# EAGLE design schema_v2_2 (EAGLE 6.4)
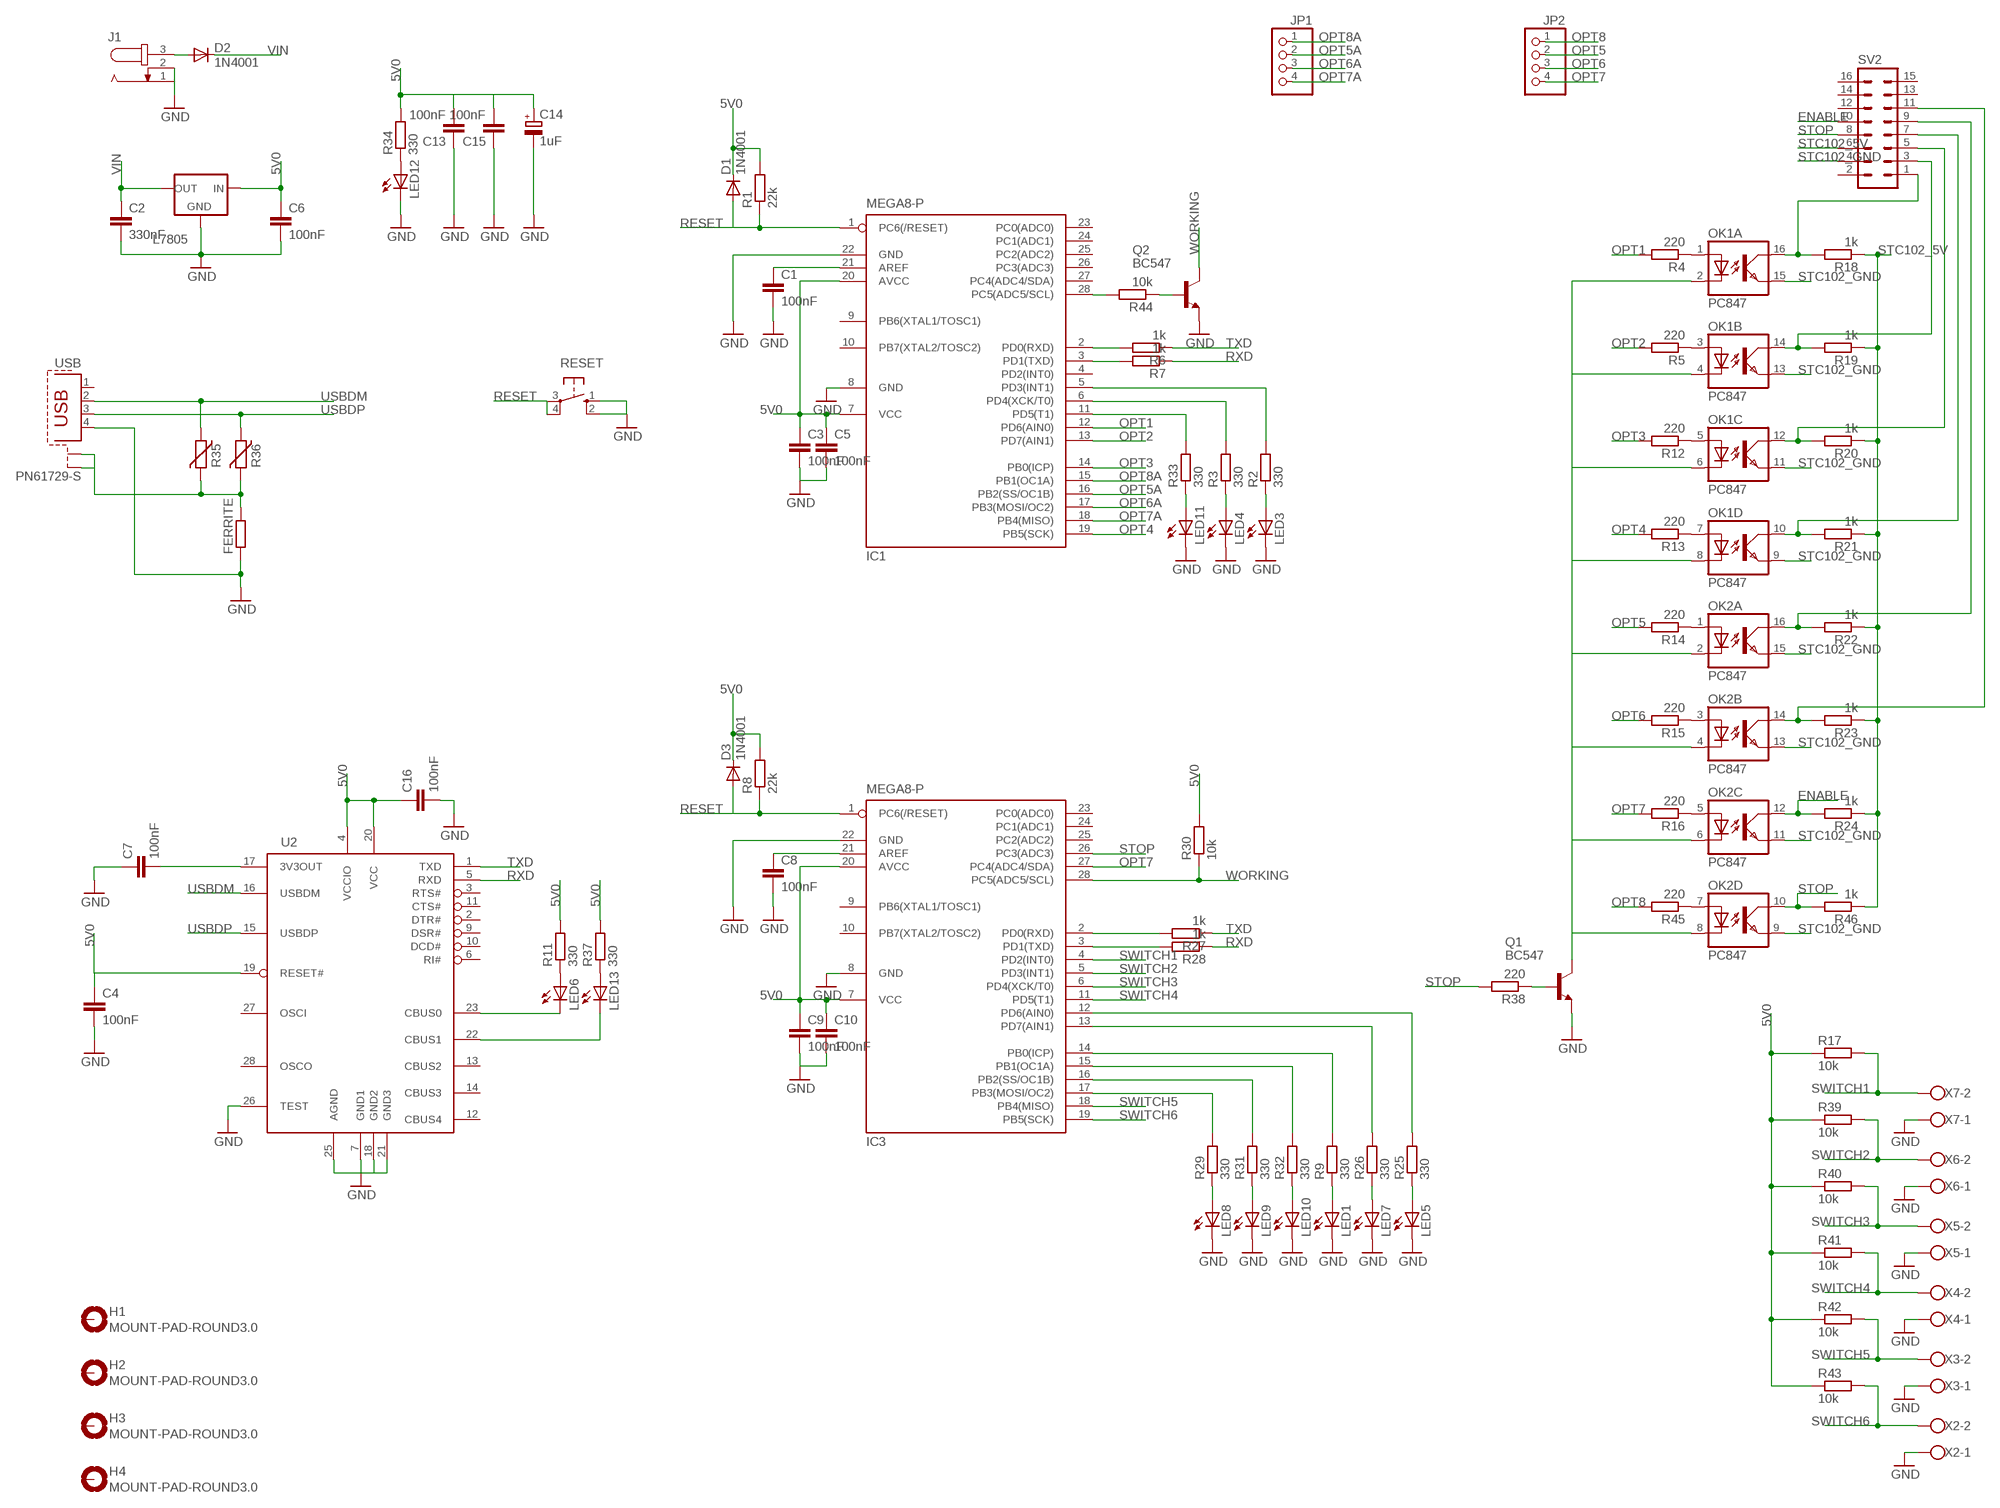
[diagram p0: schematic, sheet 1]

## Parts
C1  100nF  C-EUC0805  [C0805]
C2  330nF  C-EU025-025X050  [C025-025X050]
C3  100nF  C-EU025-025X050  [C025-025X050]
C4  100nF  C-EUC0603K  [C0603K]
C5  100nF  C-EU025-025X050  [C025-025X050]
C6  100nF  C-EU025-025X050  [C025-025X050]
C7  100nF  C-EUC0603K  [C0603K]
C8  100nF  C-EU025-025X050  [C025-025X050]
C9  100nF  C-EU025-025X050  [C025-025X050]
C10  100nF  C-EU025-025X050  [C025-025X050]
C13  100nF  C-EU025-025X050  [C025-025X050]
C14  1uF  CPOL-EUE2.5-5  [E2,5-5]
C15  100nF  C-EU025-025X050  [C025-025X050]
C16  100nF  C-EUC0603K  [C0603K]
D1  1N4001  1N4004  [DO41-10]
D2  1N4001  1N4004  [DO41-10]
D3  1N4001  1N4004  [DO41-10]
FERRITE  R-EU_M0805  [M0805]
H1  MOUNT-PAD-ROUND3.0  [3,0-PAD]
H2  MOUNT-PAD-ROUND3.0  [3,0-PAD]
H3  MOUNT-PAD-ROUND3.0  [3,0-PAD]
H4  MOUNT-PAD-ROUND3.0  [3,0-PAD]
IC1  MEGA8-P  [DIL28-3]
IC3  MEGA8-P  [DIL28-3]
J1  JACK-PLUG0  [SPC4077]
JP1  PINHD-1X4  [1X04]
JP2  PINHD-1X4  [1X04]
L7805  79XXS  [79XXS]
LED1  LED3MM  [LED3MM]
LED3  LED3MM  [LED3MM]
LED4  LED3MM  [LED3MM]
LED5  LED3MM  [LED3MM]
LED6  LED3MM  [LED3MM]
LED7  LED3MM  [LED3MM]
LED8  LED3MM  [LED3MM]
LED9  LED3MM  [LED3MM]
LED10  LED3MM  [LED3MM]
LED11  LED3MM  [LED3MM]
LED12  LED3MM  [LED3MM]
LED13  LED3MM  [LED3MM]
OK1  PC847  [DIL16]
OK2  PC847  [DIL16]
Q1  BC547  [TO92]
Q2  BC547  [TO92]
R1  22k  R-EU_0207/10  [0207/10]
R2  330  R-EU_0207/10  [0207/10]
R3  330  R-EU_0207/10  [0207/10]
R4  220  R-EU_0207/10  [0207/10]
R5  220  R-EU_0207/10  [0207/10]
R6  1k  R-EU_0207/10  [0207/10]
R7  1k  R-EU_0207/10  [0207/10]
R8  22k  R-EU_0207/10  [0207/10]
R9  330  R-EU_0207/10  [0207/10]
R11  330  R-EU_0207/10  [0207/10]
R12  220  R-EU_0207/10  [0207/10]
R13  220  R-EU_0207/10  [0207/10]
R14  220  R-EU_0207/10  [0207/10]
R15  220  R-EU_0207/10  [0207/10]
R16  220  R-EU_0207/10  [0207/10]
R17  10k  R-EU_0207/10  [0207/10]
R18  1k  R-EU_0207/10  [0207/10]
R19  1k  R-EU_0207/10  [0207/10]
R20  1k  R-EU_0207/10  [0207/10]
R21  1k  R-EU_0207/10  [0207/10]
R22  1k  R-EU_0207/10  [0207/10]
R23  1k  R-EU_0207/10  [0207/10]
R24  1k  R-EU_0207/10  [0207/10]
R25  330  R-EU_0207/10  [0207/10]
R26  330  R-EU_0207/10  [0207/10]
R27  1k  R-EU_0207/10  [0207/10]
R28  1k  R-EU_0207/10  [0207/10]
R29  330  R-EU_0207/10  [0207/10]
R30  10k  R-EU_0207/10  [0207/10]
R31  330  R-EU_0207/10  [0207/10]
R32  330  R-EU_0207/10  [0207/10]
R33  330  R-EU_0207/10  [0207/10]
R34  330  R-EU_0207/10  [0207/10]
R35  VARISTORCN0603  [CT/CN0603]
R36  VARISTORCN0603  [CT/CN0603]
R37  330  R-EU_0207/10  [0207/10]
R38  220  R-EU_0207/10  [0207/10]
R39  10k  R-EU_0207/10  [0207/10]
R40  10k  R-EU_0207/10  [0207/10]
R41  10k  R-EU_0207/10  [0207/10]
R42  10k  R-EU_0207/10  [0207/10]
R43  10k  R-EU_0207/10  [0207/10]
R44  10k  R-EU_0207/10  [0207/10]
R45  220  R-EU_0207/10  [0207/10]
R46  1k  R-EU_0207/10  [0207/10]
RESET  10-XX  [B3F-10XX]
SV2  MA08-2  [MA08-2]
U2  FT232RL  [SSOP28DB]
USB  PN61729-S  [PN61729-S]
X2  W237-102  [W237-102]
X3  W237-102  [W237-102]
X4  W237-102  [W237-102]
X5  W237-102  [W237-102]
X6  W237-102  [W237-102]
X7  W237-102  [W237-102]

## Nets
5V0: C3.1 C4.1 C5.1 C6.1 C9.1 C10.1 C13.2 C14.+ C15.2 C16.1 D1.C D3.C IC1.7(VCC) IC1.20(AVCC) IC3.7(VCC) IC3.20(AVCC) L7805.IN R1.2 R8.2 R11.2 R17.1 R30.2 R34.2 R37.2 R39.1 R40.1 R41.1 R42.1 R43.1 U2.4(VCCIO) U2.19(RESET#) U2.20(VCC)
ENABLE: OK2.12(C:COL) R24.2 SV2.10
GND: C1.2 C2.2 C3.2 C4.2 C5.2 C6.2 C7.1 C8.2 C9.2 C10.2 C13.1 C14.- C15.1 C16.2 FERRITE.1 IC1.8(GND) IC1.22(GND) IC3.8(GND) IC3.22(GND) J1.1 J1.2 L7805.GND LED1.K(C) LED3.K(C) LED4.K(C) LED5.K(C) LED7.K(C) LED8.K(C) LED9.K(C) LED10.K(C) LED11.K(C) LED12.K(C) Q1.1(E) Q2.1(E) RESET.1(S) RESET.2(S1) U2.7(GND1) U2.18(GND2) U2.21(GND3) U2.25(AGND) U2.26(TEST) USB.4 X2.1 X3.1 X4.1 X5.1 X6.1 X7.1
N$1: IC1.28(PC5(ADC5/SCL)) R44.2
N$2: LED1.A R9.1
N$3: C1.1 IC1.21(AREF)
N$4: IC1.6(PD4(XCK/T0)) R3.2
N$5: IC3.13(PD7(AIN1)) R26.2
N$6: LED3.A R2.1
N$7: LED4.A R3.1
N$8: D2.A J1.3
N$9: OK1.16(A:COL) R18.2 SV2.1
N$10: IC1.5(PD3(INT1)) R2.2
N$11: OK1.14(B:COL) R19.2 SV2.3
N$12: OK1.12(C:COL) R20.2 SV2.5
N$13: OK1.10(D:COL) R21.2 SV2.7
N$14: OK2.16(A:COL) R22.2 SV2.9
N$15: OK2.14(B:COL) R23.2 SV2.11
N$16: C8.1 IC3.21(AREF)
N$17: LED6.K(C) U2.23(CBUS0)
N$18: LED13.K(C) U2.22(CBUS1)
N$19: LED6.A R11.1
N$20: Q2.2(B) R44.1
N$21: IC3.14(PB0(ICP)) R9.2
N$22: OK2.7(D:A) R45.1
N$23: OK1.2(A:C) OK1.4(B:C) OK1.6(C:C) OK1.8(D:C) OK2.2(A:C) OK2.4(B:C) OK2.6(C:C) OK2.8(D:C) Q1.3(C)
N$24: Q1.2(B) R38.1
N$25: IC1.2(PD0(RXD)) R6.2
N$26: IC1.3(PD1(TXD)) R7.2
N$29: OK1.1(A:A) R4.1
N$30: OK1.3(B:A) R5.1
N$31: OK1.5(C:A) R12.1
N$32: OK1.7(D:A) R13.1
N$33: OK2.1(A:A) R14.1
N$34: OK2.3(B:A) R15.1
N$35: OK2.5(C:A) R16.1
N$36: LED5.A R25.1
N$38: LED7.A R26.1
N$39: LED8.A R29.1
N$40: LED10.A R32.1
N$42: LED9.A R31.1
N$43: IC3.2(PD0(RXD)) R27.2
N$44: IC3.3(PD1(TXD)) R28.2
N$45: IC3.12(PD6(AIN0)) R25.2
N$46: IC3.17(PB3(MOSI/OC2)) R29.2
N$47: IC3.16(PB2(SS/OC1B)) R31.2
N$48: IC3.15(PB1(OC1A)) R32.2
N$49: LED11.A R33.1
N$50: IC1.11(PD5(T1)) R33.2
N$51: LED12.A R34.1
N$53: FERRITE.2 R35.2 R36.2 USB.S1 USB.S2
N$55: LED13.A R37.1
N$96: C7.2 U2.17(3V3OUT)
OPT1: IC1.12(PD6(AIN0)) R4.2
OPT2: IC1.13(PD7(AIN1)) R5.2
OPT3: IC1.14(PB0(ICP)) R12.2
OPT4: IC1.19(PB5(SCK)) R13.2
OPT5: JP2.2 R14.2
OPT5A: IC1.16(PB2(SS/OC1B)) JP1.2
OPT6: JP2.3 R15.2
OPT6A: IC1.17(PB3(MOSI/OC2)) JP1.3
OPT7: IC3.27(PC4(ADC4/SDA)) JP2.4 R16.2
OPT7A: IC1.18(PB4(MISO)) JP1.4
OPT8: JP2.1 R45.2
OPT8A: IC1.15(PB1(OC1A)) JP1.1
RESET: D1.A D3.A IC1.1(PC6(/RESET)) IC3.1(PC6(/RESET)) R1.1 R8.1 RESET.3(P) RESET.4(P1)
RXD: R7.1 R28.1 U2.5(RXD)
STC102_5V: R18.1 R19.1 R20.1 R21.1 R22.1 R23.1 R24.1 R46.1 SV2.6
STC102_GND: OK1.9(D:EMIT) OK1.11(C:EMIT) OK1.13(B:EMIT) OK1.15(A:EMIT) OK2.9(D:EMIT) OK2.11(C:EMIT) OK2.13(B:EMIT) OK2.15(A:EMIT) SV2.4
STOP: IC3.26(PC3(ADC3)) OK2.10(D:COL) R38.2 R46.2 SV2.8
SWITCH1: IC3.4(PD2(INT0)) R17.2 X7.2
SWITCH2: IC3.5(PD3(INT1)) R39.2 X6.2
SWITCH3: IC3.6(PD4(XCK/T0)) R40.2 X5.2
SWITCH4: IC3.11(PD5(T1)) R41.2 X4.2
SWITCH5: IC3.18(PB4(MISO)) R42.2 X3.2
SWITCH6: IC3.19(PB5(SCK)) R43.2 X2.2
TXD: R6.1 R27.1 U2.1(TXD)
USBDM: R35.1 U2.16(USBDM) USB.2
USBDP: R36.1 U2.15(USBDP) USB.3
VIN: C2.1 D2.C L7805.OUT
WORKING: IC3.28(PC5(ADC5/SCL)) Q2.3(C) R30.1
Unconnected: H1.B3,0(MOUNT) H2.B3,0(MOUNT) H3.B3,0(MOUNT) H4.B3,0(MOUNT) IC1.4(PD2(INT0)) IC1.9(PB6(XTAL1/TOSC1)) IC1.10(PB7(XTAL2/TOSC2)) IC1.23(PC0(ADC0)) IC1.24(PC1(ADC1)) IC1.25(PC2(ADC2)) IC1.26(PC3(ADC3)) IC1.27(PC4(ADC4/SDA)) IC3.9(PB6(XTAL1/TOSC1)) IC3.10(PB7(XTAL2/TOSC2)) IC3.23(PC0(ADC0)) IC3.24(PC1(ADC1)) IC3.25(PC2(ADC2)) SV2.2 SV2.12 SV2.13 SV2.14 SV2.15 SV2.16 U2.2(DTR#) U2.3(RTS#) U2.6(RI#) U2.9(DSR#) U2.10(DCD#) U2.11(CTS#) U2.12(CBUS4) U2.13(CBUS2) U2.14(CBUS3) U2.27(OSCI) U2.28(OSCO) USB.1

## Library data of the parts
C1-C10 C13 C15 C16 = rcl:C-EU: CAPACITOR, European symbol
C14 = rcl:CPOL-EU: POLARIZED CAPACITOR, European symbol
D1-D3 = diode:1N4004: DIODE general purpose rectifier, 1 A
FERRITE = resistor:R-EU_: RESISTOR, European symbol
H1-H4 = holes:MOUNT-PAD-ROUND: MOUNTING PAD, round
IC1 IC3 = atmel:MEGA8-P: MICROCONTROLLER 8 Kbytes FLASH, 1 kbytes SRAM, 512 bytes EEPROM, USART, 4-channel 10 bit ADC, 2-channel 8 bit ADC Pin compatible with Atmega48, ATMega88, ATMega168 Source: avr.lbr; OC_FARNELL: unknown; OC_NEWARK: unknown
J1 = con-jack:JACK-PLUG: DC POWER JACK Power Jack, DC, Right Angle, Through Hole, Rated 5A at 16VDC, PC Terminals Distributor: Farnell (www.Farnell.de) Drawing: 84N1161.pdf / 84N1162.pdf Manufacturer: SPC Technology (www.spctechnology.com) Type: SPC4077 / SPC 4078; OC_FARNELL: unknown; OC_NEWARK: unknown
JP1 JP2 = pinhead:PINHD-1X4: PIN HEADER
L7805 = v-reg:79XXS: VOLTAGE REGULATOR
LED1 LED3-LED13 = led:LED: LED OSRAM: - CHIPLED LG R971, LG N971, LY N971, LG Q971, LY Q971, LO R971, LY R971 LH N974, LH R974 LS Q976, LO Q976, LY Q976 LO Q996 - Hyper CHIPLED LW Q18S LB Q993, LB Q99A, LB R99A - SideLED LS A670, LO A670, LY A670, LG A670, LP A670 LB A673, LV A673, LT A673, LW A673 LH A674 LY A675 LS A676, LA A676, LO A676, LY A676, LW A676 LS A679, LY A679, LG A679 - Hyper Micro SIDELED® LS Y876, LA Y876, LO Y876, LY Y876 LT Y87S - SmartLED LW L88C, LW L88S LB L89C, LB L89S, LG L890 LS L89K, LO L89K, LY L89K LS L896, LA L896, LO L896, LY L896 - TOPLED LS T670, LO T670, LY T670, LG T670, LP T670 LSG T670, LSP T670, LSY T670, LOP T670, LYG T670 LG T671, LOG T671, LSG T671 LB T673, LV T673, LT T673, LW T673 LH T674 LS T676, LA T676, LO T676, LY T676, LB T676, LH T676, LSB T676, LW T676 LB T67C, LV T67C, LT T67C, LS T67K, LO T67K, LY T67K, LW E67C LS E67B, LA E67B, LO E67B, LY E67B, LB E67C, LV E67C, LT E67C LW T67C LS T679, LY T679, LG T679 LS T770, LO T770, LY T770, LG T770, LP T770 LB T773, LV T773, LT T773, LW T773 LH T774 LS E675, LA E675, LY E675, LS T675 LS T776, LA T776, LO T776, LY T776, LB T776 LHGB T686 LT T68C, LB T68C - Hyper Mini TOPLED® LB M676 - Mini TOPLED Santana® LG M470 LS M47K, LO M47K, LY M47K Source: http://www.osram.convergy.de LUXEON: - LUMILED® LXK2-PW12-R00, LXK2-PW12-S00, LXK2-PW14-U00, LXK2-PW14-V00 LXK2-PM12-R00, LXK2-PM12-S00, LXK2-PM14-U00 LXK2-PE12-Q00, LXK2-PE12-R00, LXK2-PE12-S00, LXK2-PE14-T00, LXK2-PE14-U00 LXK2-PB12-K00, LXK2-PB12-L00, LXK2-PB12-M00, LXK2-PB14-N00, LXK2-PB14-P00, LXK2-PB14-Q00 LXK2-PR12-L00, LXK2-PR12-M00, LXK2-PR14-Q00, LXK2-PR14-R00 LXK2-PD12-Q00, LXK2-PD12-R00, LXK2-PD12-S00 LXK2-PH12-R00, LXK2-PH12-S00 LXK2-PL12-P00, LXK2-PL12-Q00, LXK2-PL12-R00 Source: www.luxeon.com KINGBRIGHT: KA-3528ASYC Source: www.kingbright.com
OK1 OK2 = optocoupler:PC847: SHARP OPTO COUPLER; OC_FARNELL: 9707735; OC_NEWARK: unknown
Q1 Q2 = transistor-npn:BC547*: NPN Transistor
R1-R9 R11-R34 R37-R46 = rcl:R-EU_: RESISTOR, European symbol
R35 R36 = varistor:VARISTOR: VARISTOR
RESET = switch-omron:10-XX: OMRON SWITCH; MPN: B3F-1000; OC_FARNELL: 176432; OC_NEWARK: 36M3542
SV2 = con-lstb:MA08-2: PIN HEADER; OC_FARNELL: unknown; OC_NEWARK: unknown
U2 = ftdichip-5:FT232RL: USB UART 4th Generation USB UART (USB <-> Serial) Controller
USB = con-berg:PN61729-S: BERG USB connector; OC_FARNELL: unknown; OC_NEWARK: unknown
X2-X7 = con-wago-500:W237-102: WAGO SCREW CLAMP; MPN: 237-102; OC_FARNELL: unknown; OC_NEWARK: 70K9898

## Net classes
0 default: width 0.203 mm

## Board
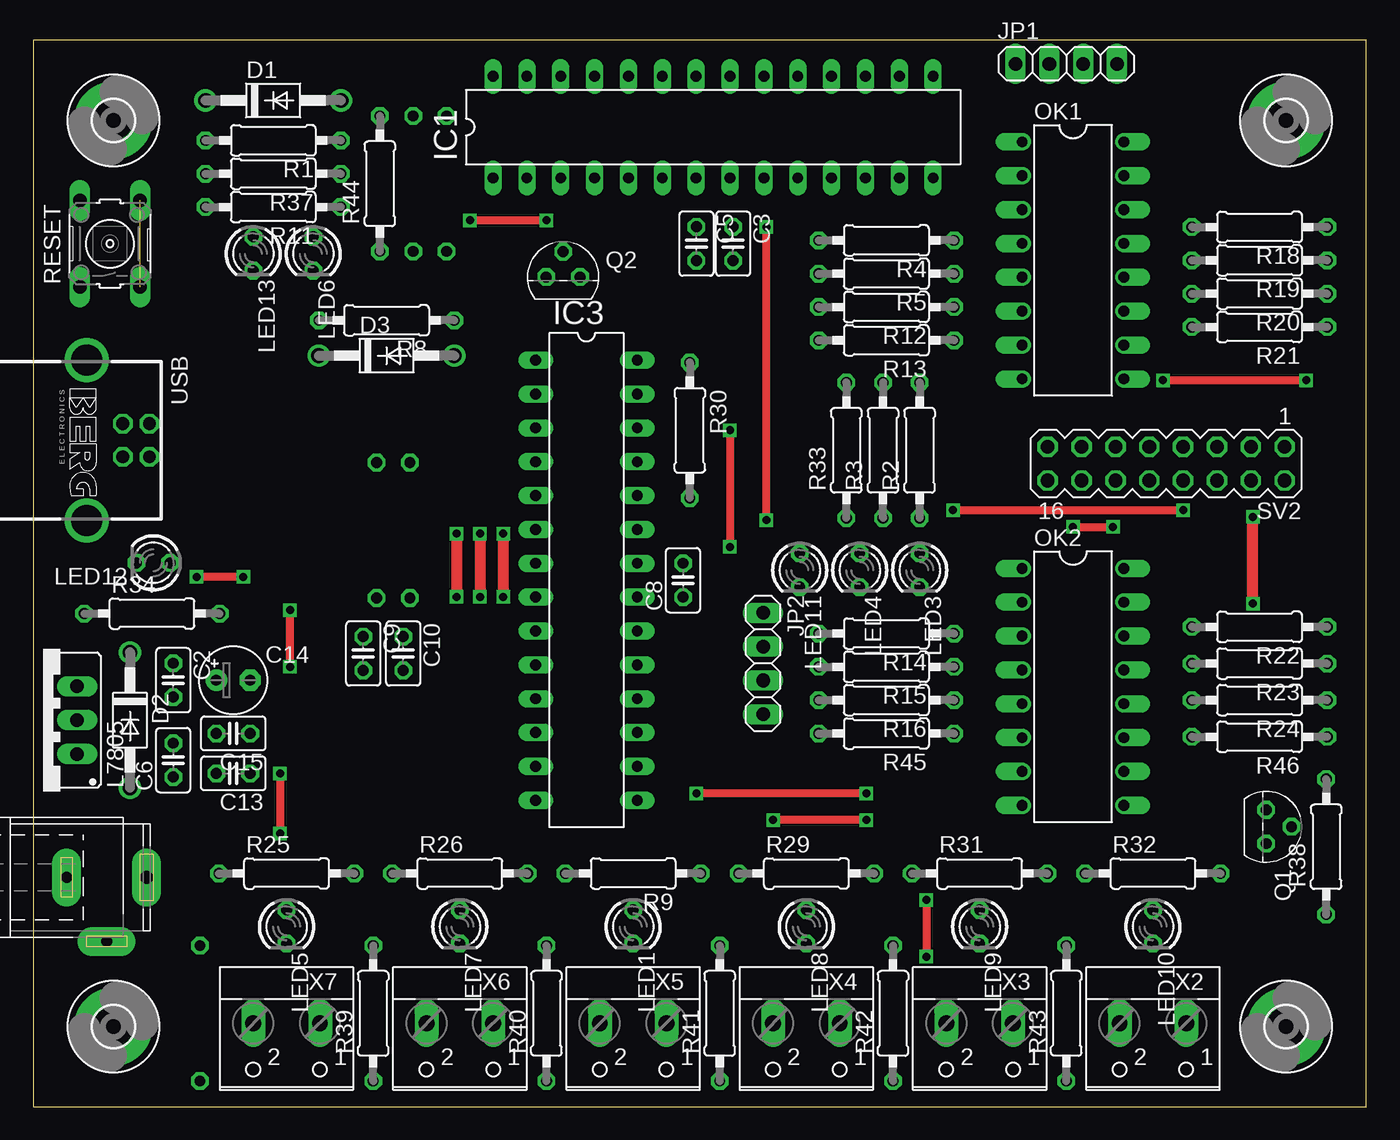
[diagram p1: board, top side]
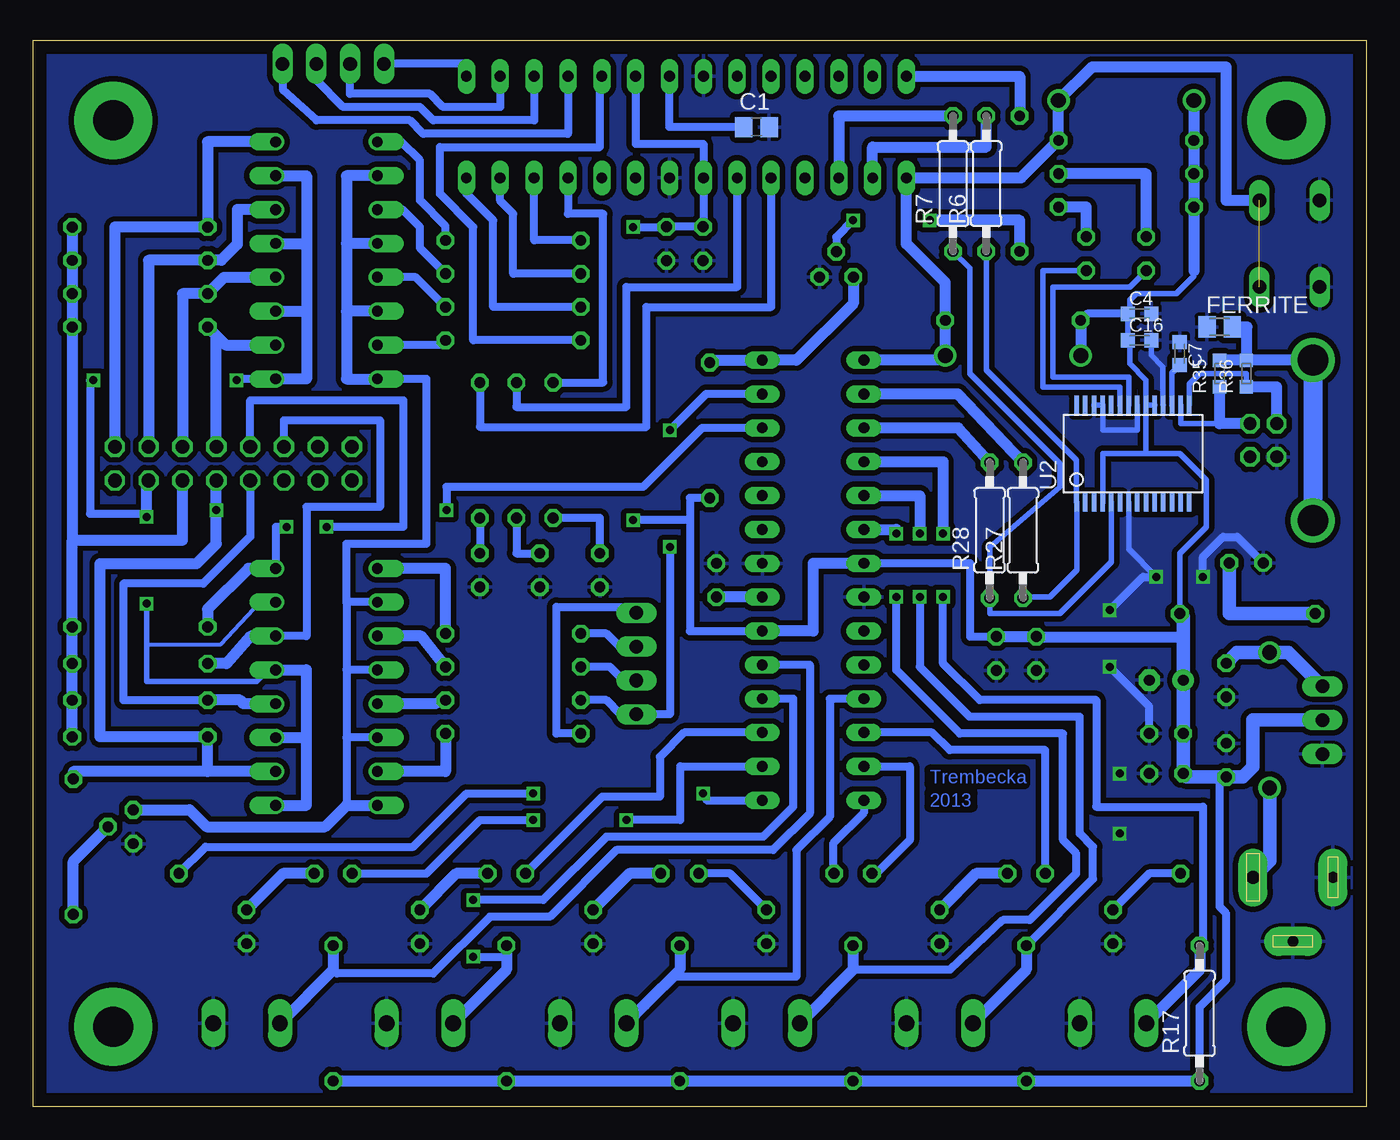
[diagram p2: board, bottom side, seen from below]

Size 100 x 80 mm. Coordinates in mm from the lower left corner, seen from the top.
Outline: 0,0 100,0 100,80 0,80 0,0
Copper layers (1*16): Top 0.035mm / dielectric 1.5mm / Bottom 0.035mm
Design rules "default": minimum track width 10mil, minimum drill 24mil, track to track 8mil, track to pad 8mil, pad to pad 8mil, via to via 8mil, smd to smd 8mil, copper to edge 40mil, drill to drill 8mil, minimum pad ring 10mil, minimum via ring 8mil, stop-mask expansion 4mil, vias tented up to drill 0mil, thermal gap 10mil

### Footprints (pad centres in the part's own frame; a part is rotated, then mirrored left to right if it is on the bottom)
C0805 = smd 1.3 x 1.5: 1 -0.95,0; 2 0.95,0
C025-025X050 = drill 0.813 octagon: 1 -1.27,0; 2 1.27,0
C0603K = smd 1.05 x 1.08: 1 -0.875,0; 2 0.875,0
E2,5-5 = drill 0.813 pad 1.6: + -1.27,0 | drill 0.813 pad 1.6 octagon: - 1.27,0
DO41-10 = drill 1.118: A 5.08,0; C -5.08,0
M0805 = smd 1.3 x 1.6: 1 -0.95,0; 2 0.95,0
3,0-PAD = drill 3 pad 5.842: B3,0 0,0
DIL28-3 = drill 0.813 long: 1 -16.51,-3.81; 2 -13.97,-3.81; 3 -11.43,-3.81; 4 -8.89,-3.81; 5 -6.35,-3.81; 6 -3.81,-3.81; 7 -1.27,-3.81; 8 1.27,-3.81; 9 3.81,-3.81; 10 6.35,-3.81; 11 8.89,-3.81; 12 11.43,-3.81; 13 13.97,-3.81; 14 16.51,-3.81; 15 16.51,3.81; 16 13.97,3.81; 17 11.43,3.81; 18 8.89,3.81; 19 6.35,3.81; 20 3.81,3.81; 21 1.27,3.81; 22 -1.27,3.81; 23 -3.81,3.81; 24 -6.35,3.81; 25 -8.89,3.81; 26 -11.43,3.81; 27 -13.97,3.81; 28 -16.51,3.81
SPC4077 = drill 0.8 pad 2.184 long: 1 -3,0; 2 0,-4.8 | drill 1 pad 2.184 long: 3 3,0
1X04 = drill 1.016 long: 1 -3.81,0; 2 -1.27,0; 3 1.27,0; 4 3.81,0
79XXS = drill 1.016 long: GND -2.54,-2.54; IN 0,-2.54; OUT 2.54,-2.54
LED3MM = drill 0.813 octagon: A -1.27,0; K 1.27,0
DIL16 = drill 0.813 offset: 1 -8.89,-3.81; 2 -6.35,-3.81; 3 -3.81,-3.81; 4 -1.27,-3.81; 5 1.27,-3.81; 6 3.81,-3.81; 7 6.35,-3.81; 8 8.89,-3.81; 9 8.89,3.81; 10 6.35,3.81; 11 3.81,3.81; 12 1.27,3.81; 13 -1.27,3.81; 14 -3.81,3.81; 15 -6.35,3.81; 16 -8.89,3.81
TO92 = drill 0.813 octagon: 1 1.27,0; 2 0,1.905; 3 -1.27,0
0207/10 = drill 0.813 octagon: 1 -5.08,0; 2 5.08,0
CT/CN0603 = smd 1 x 1: 1 -1,0; 2 1,0
B3F-10XX = drill 1.016 long: 1 -3.251,2.261; 2 3.251,2.261; 3 -3.251,-2.261; 4 3.251,-2.261
MA08-2 = drill 1.016 octagon: 1 -8.89,-1.27; 2 -8.89,1.27; 3 -6.35,-1.27; 4 -6.35,1.27; 5 -3.81,-1.27; 6 -3.81,1.27; 7 -1.27,-1.27; 8 -1.27,1.27; 9 1.27,-1.27; 10 1.27,1.27; 11 3.81,-1.27; 12 3.81,1.27; 13 6.35,-1.27; 14 6.35,1.27; 15 8.89,-1.27; 16 8.89,1.27
SSOP28DB = smd 0.348 x 1.397: 1 -4.225,-3.656; 2 -3.575,-3.656; 3 -2.925,-3.656; 4 -2.275,-3.656; 5 -1.625,-3.656; 6 -0.975,-3.656; 7 -0.325,-3.656; 8 0.325,-3.656; 9 0.975,-3.656; 10 1.625,-3.656; 11 2.275,-3.656; 12 2.925,-3.656; 13 3.575,-3.656; 14 4.225,-3.656; 15 4.225,3.656; 16 3.575,3.656; 17 2.925,3.656; 18 2.275,3.656; 19 1.625,3.656; 20 0.975,3.656; 21 0.325,3.656; 22 -0.325,3.656; 23 -0.975,3.656; 24 -1.625,3.656; 25 -2.275,3.656; 26 -2.925,3.656; 27 -3.575,3.656; 28 -4.225,3.656
PN61729-S = drill 0.95 octagon: 1 1.25,4.71; 2 -1.25,4.71; 3 -1.25,2.71; 4 1.25,2.71 | drill 2.3 pad 2.9: S1 -6.02,0; S2 6.02,0
W237-102 = drill 1.194 long: 1 -2.5,-1.27; 2 2.5,-1.27

### Placement (x,y rotation side)
C1  45.75,73.5 0 bottom
C2  10.5,32 270 top
C3  52.5,64.75 270 top
C4  17,59.5 0 bottom
C5  49.75,64.75 270 top
C6  10.5,26 90 top
C7  14,56.5 270 bottom
C8  48.75,39.5 90 top
C9  24.75,34 270 top
C10  27.75,34 270 top
C13  15,25 180 top
C14  15,32 0 top
C15  15,28 180 top
C16  17,57.5 0 bottom
D1  18,75.5 0 top
D2  7.25,29 270 top
D3  26.5,56.35 0 top
FERRITE  11,58.5 0 bottom
H1  94,74 0 top
H2  6,74 0 top
H3  6,6 0 top
H4  94,6 0 top
IC1  51,73.5 0 top
IC3  41.5,39.5 270 top
J1  5.5,17.2 0 top
JP1  77.5,78.25 0 top
JP2  54.75,33.25 270 top
L7805  0.75,29 90 top
LED1  45,13.5 270 top
LED3  66.5,40.25 270 top
LED4  62,40.25 270 top
LED5  19,13.5 270 top
LED6  21,64 270 top
LED7  32,13.5 270 top
LED8  58,13.5 270 top
LED9  71,13.5 270 top
LED10  84,13.5 270 top
LED11  57.5,40.25 270 top
LED12  9,40.8 180 top
LED13  16.5,64 270 top
OK1  78,63.5 270 top
OK2  78,31.5 270 top
Q1  92.5,21 270 top
Q2  39.75,62.25 0 top
R1  18,72.5 180 top
R2  66.5,49.25 90 top
R3  63.75,49.25 90 top
R4  64,65 180 top
R5  64,62.5 180 top
R6  28.5,69.25 90 bottom
R7  31,69.25 90 bottom
R8  26.5,59 180 top
R9  45,17.5 180 top
R11  18,67.5 180 top
R12  64,60 180 top
R13  64,57.5 180 top
R14  64,35.5 180 top
R15  64,33 180 top
R16  64,30.5 180 top
R17  12.5,7 90 bottom
R18  92,66 180 top
R19  92,63.5 180 top
R20  92,61 180 top
R21  92,58.5 180 top
R22  92,36 180 top
R23  92,33.25 180 top
R24  92,30.5 180 top
R25  19,17.5 0 top
R26  32,17.5 0 top
R27  25.75,43.25 90 bottom
R28  28.25,43.25 90 bottom
R29  58,17.5 0 top
R30  49.25,50.75 270 top
R31  71,17.5 0 top
R32  84,17.5 0 top
R33  61,49.25 90 top
R34  8.9,37 0 top
R35  11,55 90 bottom
R36  9,55 90 bottom
R37  18,70 180 top
R38  97,19.5 90 top
R39  25.5,7 90 top
R40  38.5,7 90 top
R41  51.5,7 90 top
R42  64.5,7 90 top
R43  77.5,7 90 top
R44  26,69.25 90 top
R45  64,28 180 top
R46  92,27.75 180 top
RESET  5.75,64.75 90 top
SV2  85,48.25 180 top
U2  17.5,49 0 bottom
USB  4,50 270 top
X2  84,5 180 top
X3  71,5 180 top
X4  58,5 180 top
X5  45,5 180 top
X6  32,5 180 top
X7  19,5 180 top

### Tracks (layer width: path | path; a pad name or v marks a point on that pad's centre or on a via)
5V0  (via drill 0.6)
  Top 0.61: v55,44 v55,66
  Bottom 0.406: U2.19 U2.20 | U2.20 16.52,49 | 16.52,49 19.77,49 U2.4 | 16.52,49 14,49 12,47 12,43.5 13.98,41.52 R34.2 | U2.20 16.52,54.52 17.75,55.75 17.75,57.38 C16.1 C4.1 17.75,59.62 17.75,60.5 17.25,61 14.25,61 12.92,62.33 12.92,62.7
  Bottom 0.61: R17.1 12.5,7.5 10.5,9.5 10.5,14.5 11,15 11,24.73 | IC1.20 54.81,72.25 49.73,72.25 IC1.7 49.73,66.02 C5.1 C3.1 53,66 v55,66 | 50.75,44 50.75,35.69 IC3.20 | IC3.7 29.73,40.77 29.73,35.27 C10.1 | R30.2 50.75,45.67 50.75,44 | 50.75,44 v55,44 | C4.1 20.92,59.5 R8.2
  Bottom 0.813: R17.1 R39.1 R40.1 R41.1 R42.1 R43.1 | D1.C R1.2 R37.2 R11.2 12.92,62.7 | R8.2 D3.C | IC3.7 41.5,40.77 41.5,35.69 IC3.20 | C10.1 C9.1 24.75,35.25 13.73,35.25
  Bottom 1.016: R34.2 13.73,36.75 13.73,35.25 C14.+ C15.2 C13.2 13.46,24.73 11,24.73 C6.1 9.27,24.73 8.5,25.5 8.5,29 L7805.IN
ENABLE
  Bottom 0.61: SV2.10 83.73,42.77 87.25,39.25 93.25,39.25 93.25,30.5 R24.2
  Bottom 0.813: OK2.12 84.23,30.23 84.5,30.5 R24.2
GND  (via drill 0.6)
  Top 0.61: v19.25,33 v19.25,37.25 | v15.75,39.75 v12.25,39.75 | v18.5,25 v18.5,20.5
  Bottom 0.406: U2.18 15.25,52.68 15.25,55.5 16.12,56.38 C16.2 | U2.21 17.18,50.75 19.75,50.75 19.75,52.66 U2.25 U2.26 | U2.7 17.82,41.83 v15.75,39.75
  Bottom 0.61: C15.1 16.27,30.02 v19.25,33 | v19.25,37.25 16.75,39.75 v15.75,39.75 | v12.25,39.75 12.25,41.25 10.75,42.75 9.68,42.75 LED12.K
  pour Bottom (isolate 0.406): 0,80 100,80 100,0 0,0
N$1
  Bottom 0.813: IC1.28 26,77.31 R44.2
N$2
  Bottom 0.61: LED1.A 47.73,17.5 R9.1
N$3
  Bottom 0.61: C1.1 52.27,73.5 IC1.21
N$4
  Bottom 0.61: IC1.6 47.19,61.5 55.5,61.5 55.5,52.5 63.75,52.5 R3.2
N$5
  Bottom 0.61: IC3.13 34.25,25.53 34.25,20 36.75,17.5 R26.2
N$6
  Bottom 0.61: R2.1 LED3.A
N$7
  Bottom 0.61: R3.1 63.75,41.52 LED4.A
N$8
  Bottom 1.016: D2.A 7.25,18.45 J1.3
N$9
  Bottom 0.813: OK1.16 86.92,72.39 R18.2 93.89,66 SV2.1
N$10
  Bottom 0.61: IC1.5 44.65,60 54,60 54,51 66.5,51 R2.2
N$11
  Bottom 0.813: OK1.14 84.7,67.31 84.7,64.7 85.9,63.5 R19.2 91.35,63.5 SV2.3
N$12
  Bottom 0.813: OK1.12 85.69,62.23 R20.2 88.81,61 SV2.5
N$13
  Bottom 0.813: OK1.10 85.57,57.15 R21.2 86.27,57.85 SV2.7
N$14  (via drill 0.6)
  Top 0.61: v78,43.5 v81,43.5
  Bottom 0.61: SV2.9 83.73,53 72.25,53 72.25,43.5 v78,43.5 | v81,43.5 81.81,43.5 OK2.16
  Bottom 0.813: OK2.16 83.86,40.39 86.92,37.33 R22.2
N$15
  Bottom 0.61: SV2.11 81.19,51.5 74,51.5 74,45 79.5,45 79.5,35.31 OK2.14
  Bottom 0.813: OK2.14 83.69,35.31 85.5,33.25 R23.2
N$16
  Bottom 0.813: IC3.21 C8.1
N$17
  Bottom 0.406: LED6.K 24.25,62.73 24.25,54 18.48,54 U2.23
N$18
  Bottom 0.406: LED13.K 17.73,61.5 23.5,61.5 23.5,54.75 17.82,54.75 U2.22
N$19
  Bottom 0.813: LED6.A 21,67.5 R11.1
N$20  (via drill 0.6)
  Top 0.61: v32.75,66.5 v38.5,66.5
  Bottom 0.61: v38.5,66.5 39.75,65.25 Q2.2
  Bottom 0.813: R44.1 26,66.5 v32.75,66.5
N$21
  Bottom 0.61: IC3.14 37.69,22.06 40,19.75 40,17.58 R9.2
N$22
  Bottom 0.813: R45.1 69.08,25.15 OK2.7
N$23
  Bottom 0.61: 76.5,37.85 76.5,32.77 | OK2.4 76.5,32.77 | 76.5,32.77 76.5,27.69 | OK2.6 76.5,27.69 | 76.5,27.69 76.5,22.61 | OK2.2 76.5,37.85 | 76.5,37.85 76.5,42.25 70.5,42.25 70.5,54.61 OK1.8
  Bottom 0.813: Q1.3 88.27,22.27 87,21 78.11,21 76.5,22.61 OK2.8 | OK1.2 76.5,69.85 76.5,64.77 | OK1.4 76.5,64.77 | 76.5,64.77 76.5,59.69 | OK1.6 76.5,59.69 | 76.5,59.69 76.5,54.61 OK1.8
N$24
  Bottom 0.813: R38.1 97,18.41 Q1.2
N$25
  Bottom 0.813: IC1.2 37.03,72 28.5,72 R6.2
N$26
  Bottom 0.813: R7.2 39.57,74.33 IC1.3
N$29
  Bottom 0.61: R4.1 69.08,66.08 71,68 71,71 72.39,72.39 OK1.1
N$30
  Bottom 0.61: R5.1 71,64.42 71,66 72.31,67.31 OK1.3
N$31
  Bottom 0.61: R12.1 71.31,62.23 OK1.5
N$32
  Bottom 0.61: R13.1 69.43,57.15 OK1.7
N$33
  Bottom 0.813: R14.1 69.08,40.39 OK2.1
N$34
  Bottom 0.813: R15.1 70.89,35.31 OK2.3
N$35
  Bottom 0.813: R16.1 69.85,30.23 OK2.5
N$36
  Bottom 0.61: R25.1 16.27,17.5 LED5.A
N$38
  Bottom 0.813: R26.1 29.27,17.5 LED7.A
N$39
  Bottom 0.813: R29.1 55.27,17.5 LED8.A
N$40
  Bottom 0.813: R32.1 81.27,17.5 LED10.A
N$42
  Bottom 0.813: R31.1 68.27,17.5 LED9.A
N$43
  Bottom 0.813: R27.2 30.64,53.47 IC3.2
N$44
  Bottom 0.813: R28.2 30.6,50.93 IC3.3
N$45
  Bottom 0.61: R25.2 24.08,26.75 31.25,26.75 32.57,28.07 IC3.12
N$46
  Bottom 0.61: IC3.17 51.18,28.07 53,26.25 53,23.25 57.33,23.25 R29.2
N$47  (via drill 0.6)
  Top 0.61: v62.5,21.5 v55.5,21.5
  Bottom 0.61: R31.2 70.5,17.5 66.5,21.5 v62.5,21.5 | IC3.16 51.47,25.53 51.47,21.5 v55.5,21.5
N$48  (via drill 0.6)
  Top 0.61: v62.5,23.5 v49.75,23.5
  Bottom 0.61: R32.2 87.08,19.5 71.5,19.5 67.5,23.5 v62.5,23.5 | v49.75,23.5 49.49,22.99 IC3.15
N$49
  Bottom 0.61: LED11.A 57.5,44.17 R33.1
N$50
  Bottom 0.61: IC1.11 59.89,67 57.25,67 57.25,54.33 R33.2
N$51
  Bottom 1.016: R34.1 10.27,37 LED12.A
N$53
  Bottom 0.813: R36.2 8.95,56 8.95,58.5 FERRITE.2 | R36.2 R35.2 | USB.S1 4,56 R36.2
  Bottom 1.422: USB.S1 USB.S2
N$55
  Bottom 0.813: LED13.A 16.5,70 R37.1
N$96
  Bottom 0.406: C7.2 14.57,55.05 U2.17
OPT1
  Bottom 0.61: R4.2 62.43,65 IC1.12
OPT2
  Bottom 0.61: R5.2 64,62.5 64,67 64.97,67.97 IC1.13
OPT3
  Bottom 0.61: R12.2 65.5,60 65.5,66.5 67.5,68.5 IC1.14
OPT4
  Bottom 0.61: R13.2 67,57.5 67,66 69.5,68.5 69.5,72 57.5,72 57.5,77.31 IC1.19
OPT5
  Bottom 0.61: JP2.2 56.02,34.52 57,35.5 R14.2
OPT5A
  Bottom 0.61: IC1.16 64.97,75 69.25,75 70.25,76 76.25,76 76.25,78 JP1.2
OPT6
  Bottom 0.61: JP2.3 55.73,31.98 56.75,33 R15.2
OPT6A
  Bottom 0.61: IC1.17 62.43,74 70,74 71,75 76.75,75 78.75,77 JP1.3
OPT7  (via drill 0.6)
  Top 0.61: v52.25,50.75 v52.25,42
  Bottom 0.61: R16.2 57,30.5 55.94,29.44 JP2.4 52.25,29.44 v52.25,42 | IC3.27 49.53,53.47 v52.25,50.75
OPT7A
  Bottom 0.61: IC1.18 59.89,73 70.75,73 71.75,74 78.75,74 81.25,76.25 81.25,78.19 JP1.4
OPT8
  Bottom 0.61: R45.2 60.75,28 60.75,37.5 55.19,37.5 JP2.1
OPT8A
  Bottom 0.61: IC1.15 67.51,78.25 JP1.1
RESET  (1 unrouted)
  Bottom 0.813: 37.6,56.1 IC3.1 31.58,56.01 D3.A R8.1 31.58,61.83 34.5,64.75 IC1.1 25.89,69.69 R1.1 D1.A 20.58,78 10.5,78 10.5,68 RESET.4
RXD
  Bottom 0.406: R7.1 29.75,62.92 29.75,55 23,48.25 23,46.5 28.25,42 R28.1 28.25,37 23,37 19.12,40.88 U2.5
STC102_5V
  Bottom 0.813: R46.1 R24.1 R23.1 R22.1 97.08,42.5 | 97.08,42.5 88.81,42.5 SV2.6 | R18.1 R19.1 R20.1 R21.1 97.08,42.5
STC102_GND  (via drill 0.6)
  Top 0.61: v84.75,54.5 v95.5,54.5
  Top 0.813: v91.5,37.75 v91.5,44.25
  Bottom 0.305: 91.5,34.65 86,34.65 83,37.85 OK2.15
  Bottom 0.406: 79.5,32.77 79.5,32.75 82.4,32.75 83.25,31.9 91.5,31.9 91.5,34.65 v91.5,37.75
  Bottom 0.61: OK1.9 84.75,54.61 v84.75,54.5 | v95.5,54.5 95.75,54.5 95.75,44.5 91.5,44.5 v91.5,44.25
  Bottom 0.813: OK2.9 79.5,22.61 79.5,27.69 | OK2.11 79.5,27.69 | 79.5,27.69 79.5,32.77 OK2.13 | OK1.15 79.5,69.85 79.5,64.77 | OK1.13 79.5,64.77 | 79.5,64.77 79.5,59.69 | OK1.11 79.5,59.69 | 79.5,59.69 79.5,54.61 OK1.9 | v91.5,44.25 91.5,46.83 SV2.4
STOP  (via drill 0.6)
  Top 0.61: v69,44.75 v86.27,44.75
  Bottom 0.61: IC3.26 49.82,50.93 54.25,46.5 69,46.5 v69,44.75
  Bottom 0.813: OK2.10 86.92,25.15 | 86.92,25.15 R46.2 95,27.75 95,40.75 87.75,40.75 86.27,42.23 v86.27,44.75 SV2.8 | 86.92,25.15 97,25.15 R38.2
SWITCH1  (via drill 0.6)
  Top 0.813: v31.75,43 v31.75,38.25
  Bottom 0.61: 12.25,12.08 12.25,22.5 20.25,22.5 20.25,30.5 29,30.5 31.75,33.25 v31.75,38.25
  Bottom 0.813: X7.2 12.5,10.27 R17.2 12.25,12.08 | IC3.4 31.75,48.39 v31.75,43
SWITCH2  (via drill 0.6)
  Top 0.813: v33.5,43 v33.5,38.25
  Bottom 0.61: R39.2 20.5,17.08 20.5,19.5 21.5,20.5 21.5,29.25 29.75,29.25 33.5,33 v33.5,38.25
  Bottom 0.813: R39.2 25.5,10.27 X6.2 | IC3.5 33.5,45.85 v33.5,43
SWITCH3  (via drill 0.6)
  Top 0.813: v35.25,43 v35.25,38.25
  Bottom 0.61: 38.5,10.27 31.23,10.27 27.25,14 25.25,14 21.75,17.5 21.75,19 22.75,20 22.75,28 30.5,28 35.25,32.75 v35.25,38.25
  Bottom 0.813: R40.2 38.5,10.27 X5.2 | IC3.6 35.25,43.31 v35.25,43
SWITCH4
  Bottom 0.61: IC3.11 40.25,30.61 40.25,21.75 42.75,19.25 42.75,9.75 52.02,9.75 54.13,7.63
  Bottom 0.813: R41.2 51.5,10.27 54.13,7.63 X4.2
SWITCH5  (via drill 0.6)
  Top 0.61: v67,15.5 v67,11.25
  Bottom 0.61: v67,15.5 61.75,15.5 57,20.25 45.25,20.25 43,22.5 43,30.61 IC3.18 | v67,11.25 64.75,11.25 64.5,11.5
  Bottom 0.813: R42.2 64.5,11.5 64.5,10.27 X3.2
SWITCH6
  Bottom 0.61: 77.5,10.27 77.23,10 70,10 65.75,14.25 61.25,14.25 56.25,19.25 44.5,19.25 41.75,22 41.75,33.15 IC3.19
  Bottom 0.813: R43.2 77.5,10.27 X2.2
TXD
  Bottom 0.406: R6.1 28.5,55.25 21.75,48.5 21.75,45.37 U2.1 21.73,40.27 23.75,38.25 25.67,38.25 R27.1
USBDM
  Bottom 0.406: U2.16 13.93,51.25 11,51.25
  Bottom 0.813: USB.2 11,51.25 R35.1
USBDP
  Bottom 0.406: R36.1 9,55 12.5,55 13.28,54.23 U2.15
  Bottom 0.813: USB.3 6.71,54 R36.1
VIN
  Bottom 1.016: L7805.OUT 5.83,34.08 D2.C 9.69,34.08 C2.1
WORKING
  Bottom 0.813: R30.1 49.25,56.01 IC3.28 42.75,56 38.48,60.27 Q2.3

### Text on the board
Bottom: Trembecka | 2013